# EasyEDA schematic Sheet_1.json
TITLE: pcb; REV: 1.0; Date: 2020-10-28; Sheet: 1/1; Drawn By: up201603781; Company: Your Company
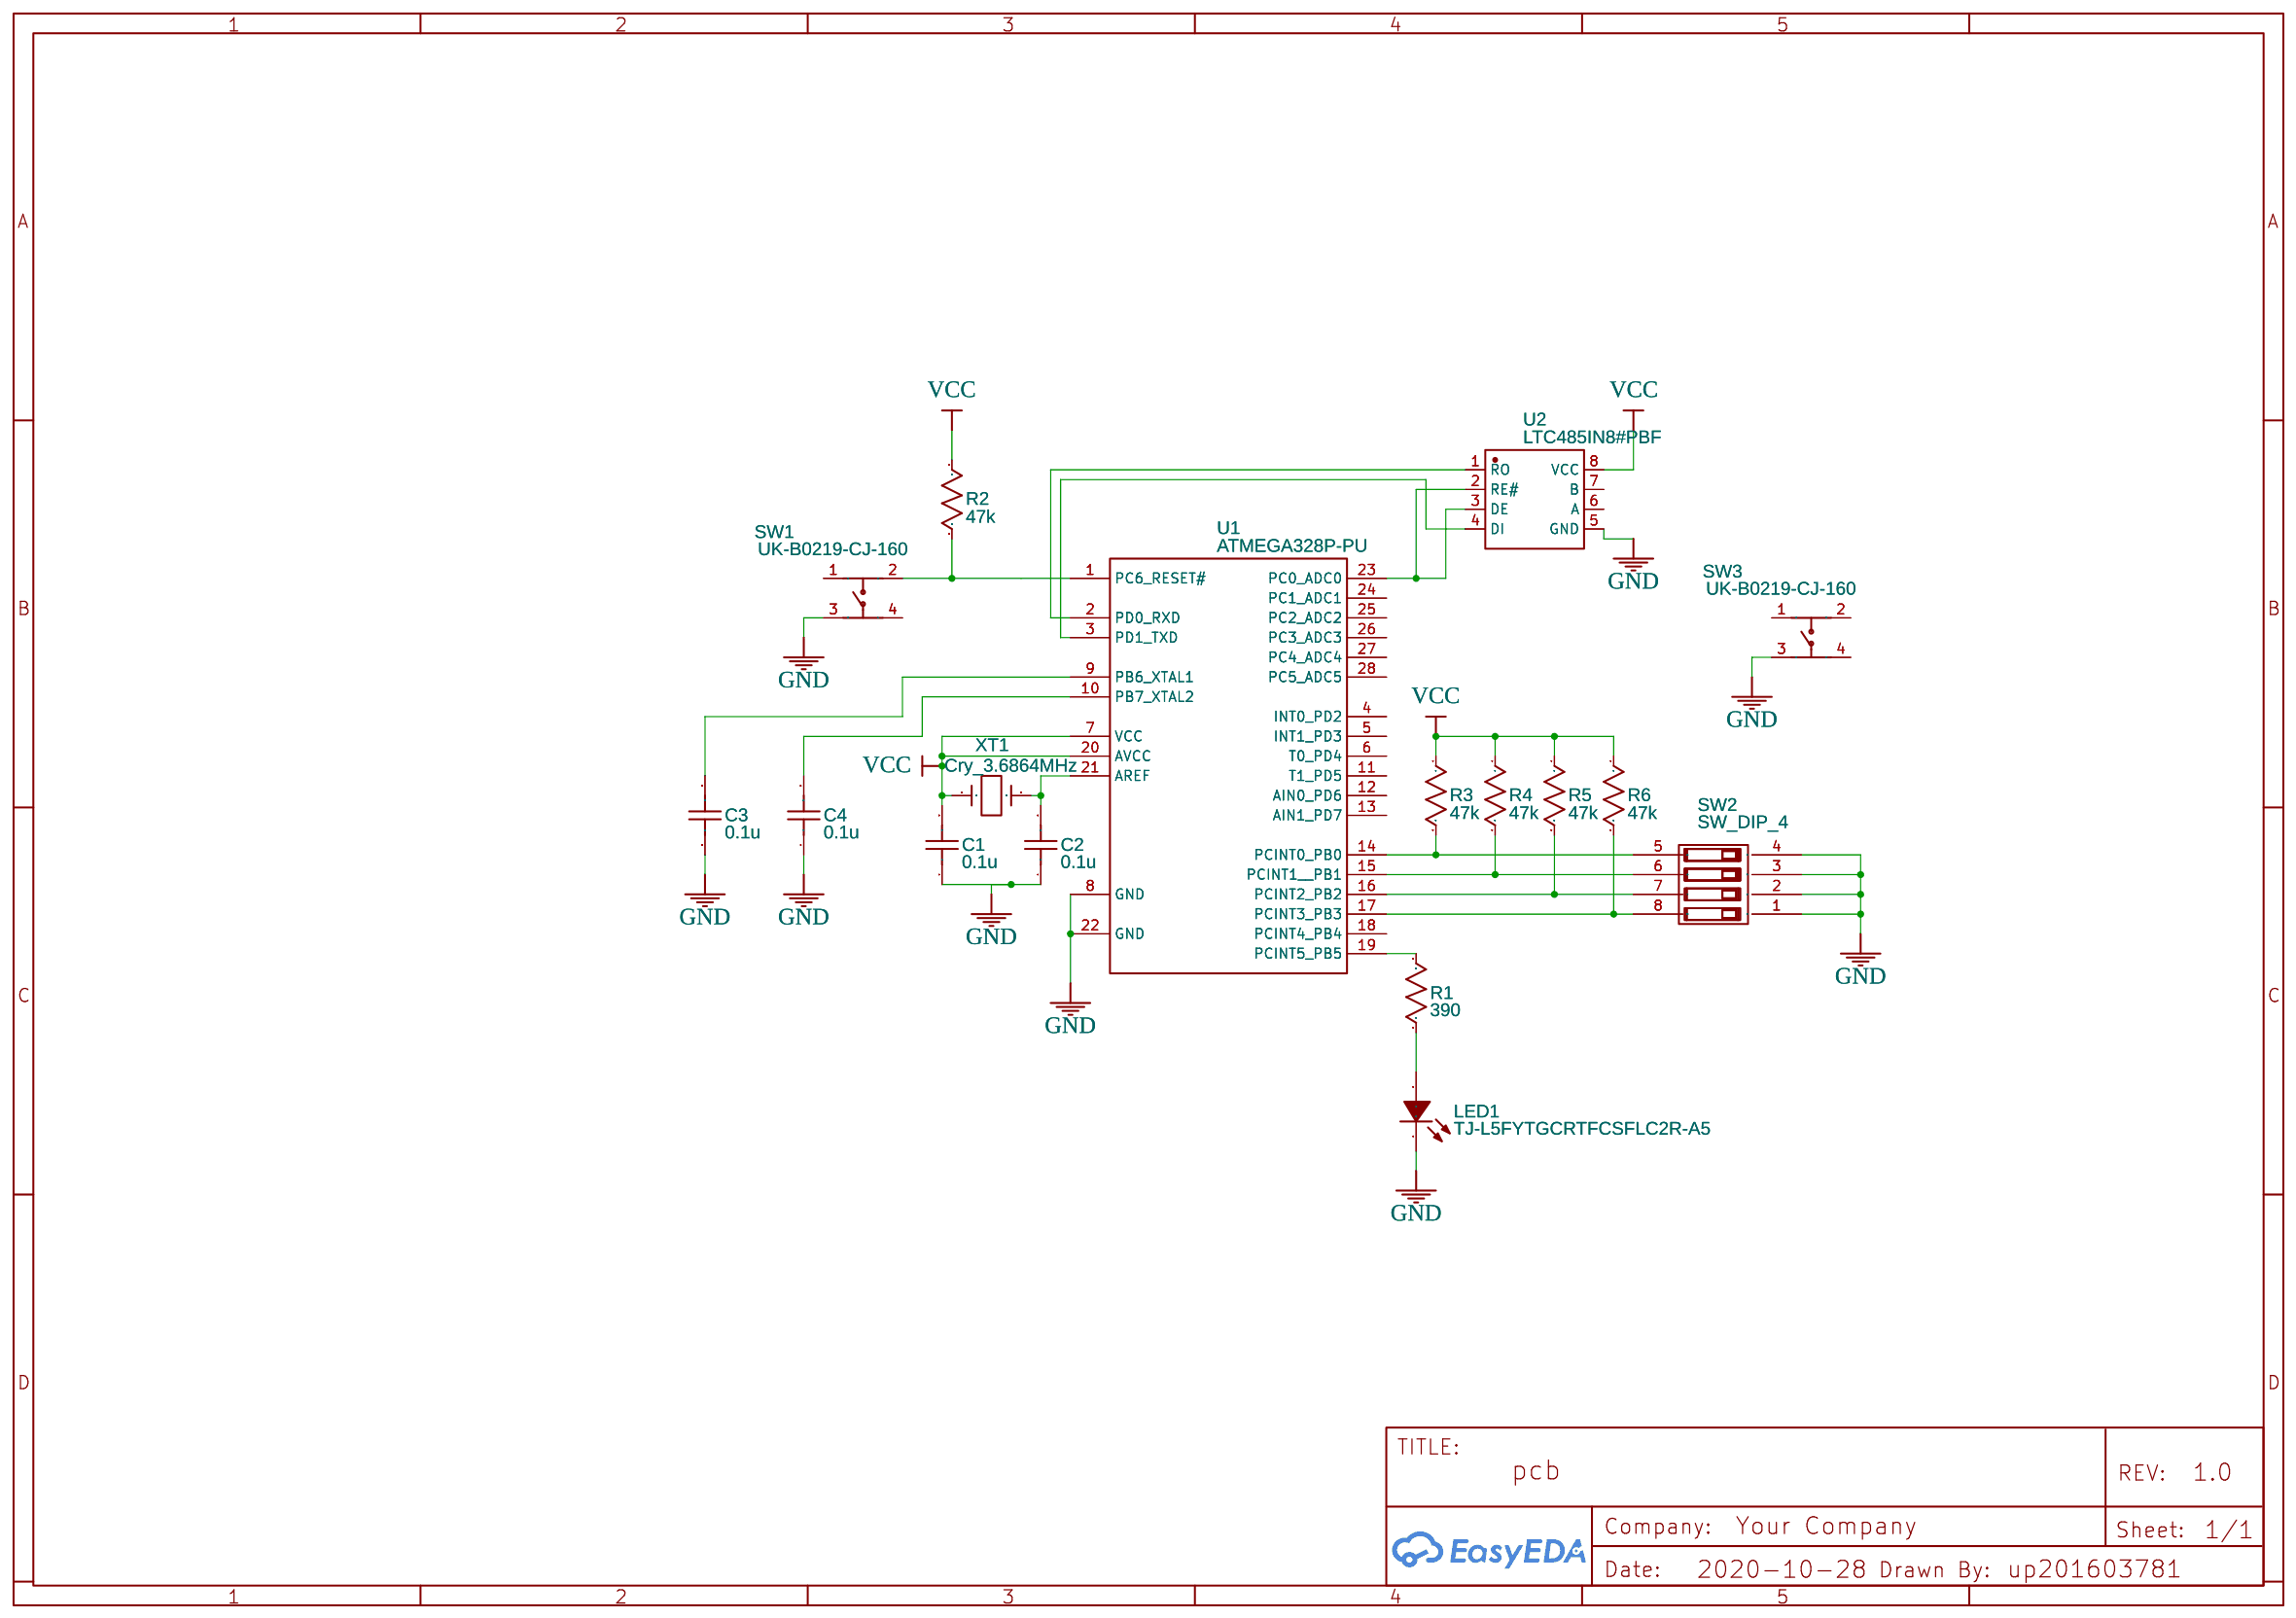
[diagram p0: schematic sheet]

## Parts
C1  0.1u  [C0603]
C2  0.1u  [C0603]
C3  0.1u  [C0603]
C4  0.1u  [C0603]
LED1  TJ-L5FYTGCRTFCSFLC2R-A5  [LED-TH_BD5.8-P2.54-FD]
R1  390  [R0603]
R2  47k  [R0603]
R3  47k  [R0603]
R4  47k  [R0603]
R5  47k  [R0603]
R6  47k  [R0603]
SW1  UK-B0219-CJ-160  [SW-TH_4P-L6.0-W6.0-P4.50-LS6.5]
SW2  SW_DIP_4
SW3  UK-B0219-CJ-160  [SW-TH_4P-L6.0-W6.0-P4.50-LS6.5]
U1  ATMEGA328P-PU  [DIP-28_L34.6-W7.3-P2.54-LS10.2-BL]
U2  LTC485IN8#PBF  [PDIP-8_L10.2-W5.9-P2.54-LS7.6-BL]
XT1  Cry_3.6864MHz  [HC49/US]

## Library data of the parts
C1-C4 = C_0603_US: Contributor: LCEDA_Lib
LED1 = TJ-L5FYTGCRTFCSFLC2R-A5: Supplier: LCSC; Supplier Part: C331032; Manufacturer: TOGIALED; Contributor: LCSC
R1-R6 = R_0603_US: Contributor: LCEDA_Lib
SW1 SW3 = UK-B0219-CJ-160: Supplier: LCSC; Supplier Part: C780498; Manufacturer: USAKRO; Contributor: LCSC
SW2 = SW_DIP_4
U1 = ATMEGA328P-PU: sourceId: Oic6oiASL; Supplier: LCSC; Manufacturer: MICROCHIP; image: //image.lceda.cn/szlcsc/C33901.jpg; Contributor: LCSC; Supplier Part: C33901
U2 = LTC485IN8#PBF: Supplier: LCSC; Supplier Part: C688606; Manufacturer: Analog Devices; Contributor: LCSC
XT1 = Cry_3.6864MHz: Manufacturer: ECS Inc.; Manufacturer Part: ECS-36-20-5PXDN-TR; Supplier Part: XC1293CT-ND; Supplier: Digi-Key; link: https://www.digikey.com/product-detail/en/ecs-inc/ECS-36-S-5PX-TR/XC1235CT-ND/827699; Contributor: Bradley McGill

## Nets
GND: C1.1 C2.1 C3.1 C4.1 LED1.2(C) SW1.3 SW2.1 SW2.2 SW2.3 SW2.4 SW3.3 U1.8(GND) U1.22(GND) U2.5(GND)
VCC: C1.2 R2.1 R3.1 R4.1 R5.1 R6.1 U1.7(VCC) U1.20(AVCC) U2.8(VCC) XT1.1
Net-(C2-2): C2.2 U1.21(AREF) XT1.2
Net-(C3-2): C3.2 U1.9(PB6 XTAL1)
Net-(C4-2): C4.2 U1.10(PB7 XTAL2)
Net-(LED1-1): LED1.1(A) R1.1
Net-(R1-2): R1.2 U1.19(PCINT5 PB5)
Net-(R2-2): R2.2 SW1.2 U1.1(PC6 RESET#)
Net-(R3-2): R3.2 SW2.5 U1.14(PCINT0 PB0)
Net-(R4-2): R4.2 SW2.6 U1.15(PCINT1  PB1)
Net-(R5-2): R5.2 SW2.7 U1.16(PCINT2 PB2)
Net-(R6-2): R6.2 SW2.8 U1.17(PCINT3 PB3)
Net-(U1-2): U1.2(PD0 RXD) U2.1(RO)
Net-(U1-3): U1.3(PD1 TXD) U2.4(DI)
Net-(U1-23): U1.23(PC0 ADC0) U2.2(RE#) U2.3(DE)

Not connected (* = marked no-connect by the designer): SW1 1 4; SW3 1 2 4; U1 4(INT0 PD2) 5(INT1 PD3) 6(T0 PD4) 11(T1 PD5) 12(AIN0 PD6) 13(AIN1 PD7) 18(PCINT4 PB4) 24(PC1 ADC1) 25(PC2 ADC2) 26(PC3 ADC3) 27(PC4 ADC4) 28(PC5 ADC5); U2 6(A) 7(B)
